# Altium schematic sheet MainBlock-Inputs.SchDoc
size A4
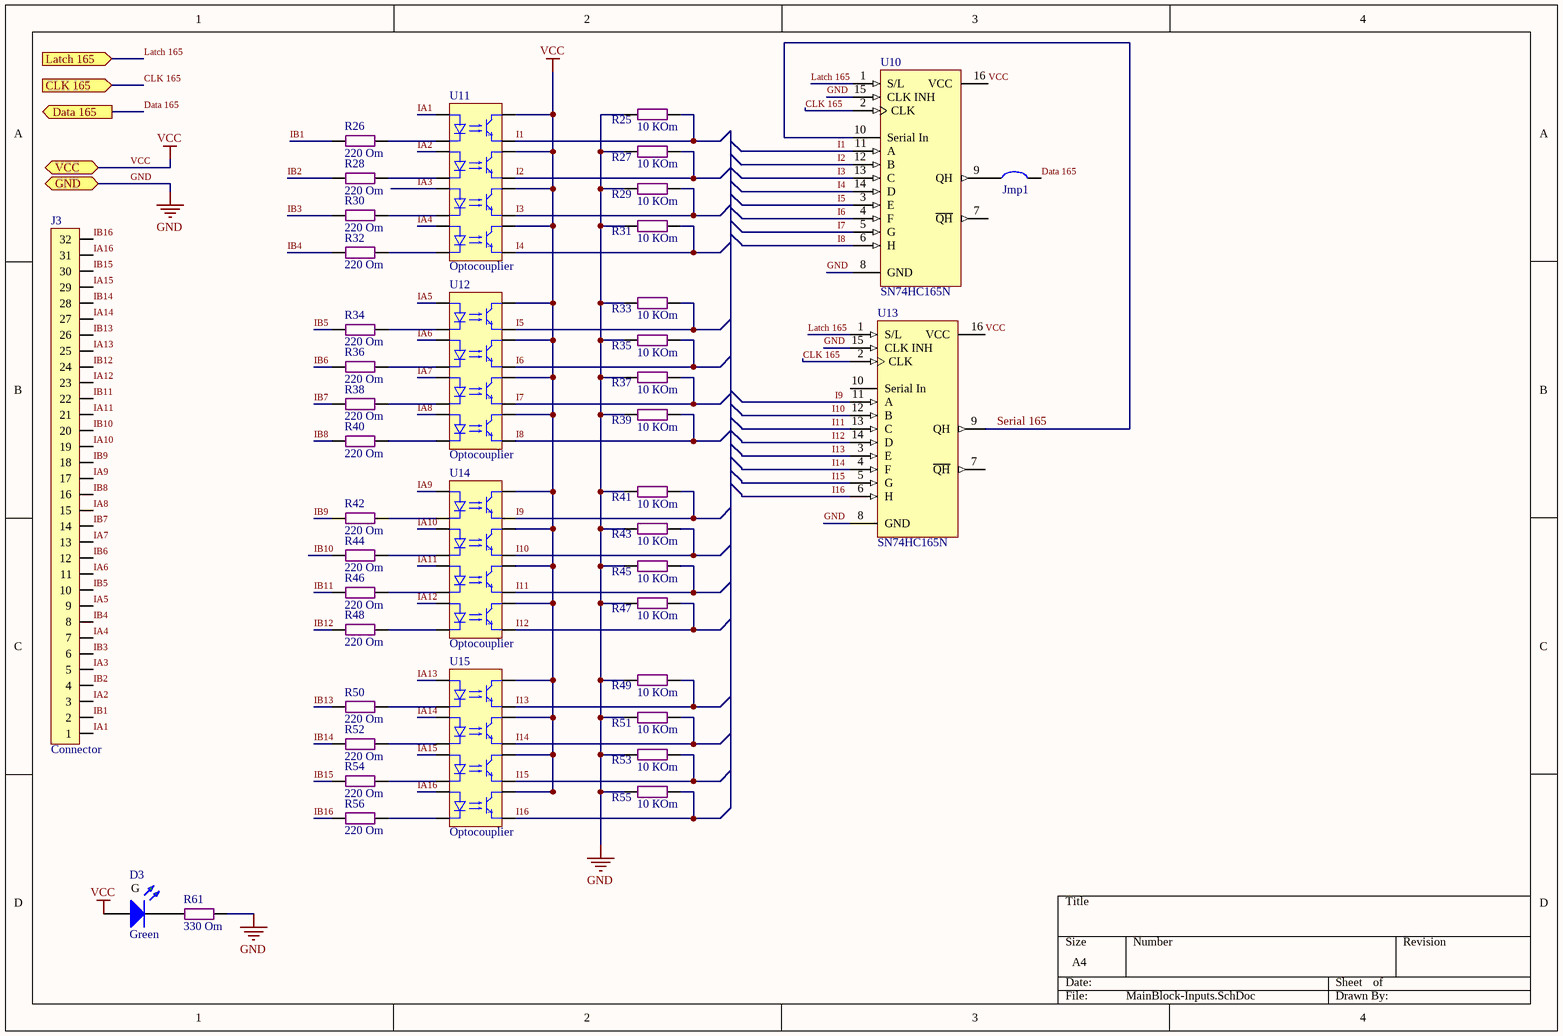
[diagram p0: MainBlock-Inputs.SchDoc]

## Parts
D3  Green  [LED SMD 0805 Green]
J3  Connector  [LINE 2.54 x 16D]
Jmp1  Jumper  [Jumper S 13x4]  (value not drawn)
R25  10 КOm  [SMD 0603 (1608)]
R26  220 Om  [SMD 1206 (3216)]
R27  10 КOm  [SMD 0603 (1608)]
R28  220 Om  [SMD 1206 (3216)]
R29  10 КOm  [SMD 0603 (1608)]
R30  220 Om  [SMD 1206 (3216)]
R31  10 КOm  [SMD 0603 (1608)]
R32  220 Om  [SMD 1206 (3216)]
R33  10 КOm  [SMD 0603 (1608)]
R34  220 Om  [SMD 1206 (3216)]
R35  10 КOm  [SMD 0603 (1608)]
R36  220 Om  [SMD 1206 (3216)]
R37  10 КOm  [SMD 0603 (1608)]
R38  220 Om  [SMD 1206 (3216)]
R39  10 КOm  [SMD 0603 (1608)]
R40  220 Om  [SMD 1206 (3216)]
R41  10 КOm  [SMD 0603 (1608)]
R42  220 Om  [Res p7.62 (4p)]
R43  10 КOm  [SMD 0603 (1608)]
R44  220 Om  [Res p7.62 (4p)]
R45  10 КOm  [SMD 0603 (1608)]
R46  220 Om  [Res p7.62 (4p)]
R47  10 КOm  [SMD 0603 (1608)]
R48  220 Om  [Res p7.62 (4p)]
R49  10 КOm  [SMD 0603 (1608)]
R50  220 Om  [SMD 1206 (3216)]
R51  10 КOm  [SMD 0603 (1608)]
R52  220 Om  [SMD 1206 (3216)]
R53  10 КOm  [SMD 0603 (1608)]
R54  220 Om  [SMD 1206 (3216)]
R55  10 КOm  [SMD 0603 (1608)]
R56  220 Om  [SMD 1206 (3216)]
R61  330 Om  [SMD 0603 (1608)]
U10  SN74HC165N  [DIP16]
U11  Optocouplier  [DIP16]
U12  Optocouplier  [DIP16]
U13  SN74HC165N  [DIP16]
U14  Optocouplier  [DIP16]
U15  Optocouplier  [DIP16]

## Ports
CLK 165 (in), Data 165 (out), GND, Latch 165 (in), VCC

## Nets
GND: R25.1 R27.1 R29.1 R31.1 R33.1 R35.1 R37.1 R39.1 R41.1 R43.1 R45.1 R47.1 R49.1 R51.1 R53.1 R55.1 R61.2 U10.8(GND) U10.15(CLK_INH) U13.8(GND) U13.15(CLK_INH) ; port GND
VCC: D3.A U10.16(VCC) U11.10 U11.12 U11.14 U11.16 U12.10 U12.12 U12.14 U12.16 U13.16(VCC) U14.10 U14.12 U14.14 U14.16 U15.10 U15.12 U15.14 U15.16 ; port VCC
CLK 165: U10.2(CLK) U13.2(CLK) ; port CLK 165
Data 165: Jmp1.2 ; port Data 165
I1: R25.2 U10.11(A) U11.15
I2: R27.2 U10.12(B) U11.13
I3: R29.2 U10.13(C) U11.11
I4: R31.2 U10.14(D) U11.9
I5: R33.2 U10.3(E) U12.15
I6: R35.2 U10.4(F) U12.13
I7: R37.2 U10.5(G) U12.11
I8: R39.2 U10.6(H) U12.9
I9: R41.2 U13.11(A) U14.15
I10: R43.2 U13.12(B) U14.13
I11: R45.2 U13.13(C) U14.11
I12: R47.2 U13.14(D) U14.9
I13: R49.2 U13.3(E) U15.15
I14: R51.2 U13.4(F) U15.13
I15: R53.2 U13.5(G) U15.11
I16: R55.2 U13.6(H) U15.9
IA1: J3.1 U11.1
IA2: J3.3 U11.3
IA3: J3.5 U11.5
IA4: J3.7 U11.7
IA5: J3.9 U12.1
IA6: J3.11 U12.3
IA7: J3.13 U12.5
IA8: J3.15 U12.7
IA9: J3.17 U14.1
IA10: J3.19 U14.3
IA11: J3.21 U14.5
IA12: J3.23 U14.7
IA13: J3.25 U15.1
IA14: J3.27 U15.3
IA15: J3.29 U15.5
IA16: J3.31 U15.7
IB1: J3.2 R26.1
IB2: J3.4 R28.1
IB3: J3.6 R30.1
IB4: J3.8 R32.1
IB5: J3.10 R34.1
IB6: J3.12 R36.1
IB7: J3.14 R38.1
IB8: J3.16 R40.1
IB9: J3.18 R42.1
IB10: J3.20 R44.1
IB11: J3.22 R46.1
IB12: J3.24 R48.1
IB13: J3.26 R50.1
IB14: J3.28 R52.1
IB15: J3.30 R54.1
IB16: J3.32 R56.1
Latch 165: U10.1(S/L) U13.1(S/L) ; port Latch 165
Serial 165: U10.10(Serial_In) U13.9(QH)
NetD3_K: D3.K R61.1
NetJmp1_1: Jmp1.1 U10.9(QH)
NetR26_2: R26.2 U11.2
NetR28_2: R28.2 U11.4
NetR30_2: R30.2 U11.6
NetR32_2: R32.2 U11.8
NetR34_2: R34.2 U12.2
NetR36_2: R36.2 U12.4
NetR38_2: R38.2 U12.6
NetR40_2: R40.2 U12.8
NetR42_2: R42.2 U14.2
NetR44_2: R44.2 U14.4
NetR46_2: R46.2 U14.6
NetR48_2: R48.2 U14.8
NetR50_2: R50.2 U15.2
NetR52_2: R52.2 U15.4
NetR54_2: R54.2 U15.6
NetR56_2: R56.2 U15.8

Not connected (* = marked no-connect by the designer): U10 7(~{QH}); U13 7(~{QH}) 10(Serial_In)

## Notes on the sheet
- (in symbol Led SMD 0805 Green) G

## Library data of the parts
D3 = Led SMD 0805 Green: ?2v ?20mA; Forward Voltage TYP: ?2; Resistor for 5v VCC: 330 Om; Forward Voltage Min: ?; Wave len min/typ: ?; Liminous Min (mcd): ?; Liminous Typ (mcd): ?; Forward Amp (mA): ?; Color: Green
J3 = Connector Dbl ( 32 pin ): 32pin Connector
R25-R56 R61 = Resistor
U10 U13 = SN74HC165N: 8-Bit Parallel-Load Shift Register; Published: 8-Jun-2000; LatestRevisionDate: 04-Mar-2005; LatestRevisionNote: Stylized 3D Model Added.; DatasheetVersion: May-1997; PackageVersion: Oct-1995; PackageReference: N016; Publisher: Altium Limited; PackageDescription: DIP; 16 Leads; Row Spacing 7.62 mm; Pitch 2.54 mm; Code_JEDEC: MS-001-BB; ComponentLink1Description: Manufacturer Link; ComponentLink1URL: http://www.ti.com/; ComponentLink2Description: Datasheet; ComponentLink2URL: http://www-s.ti.com/sc/ds/sn74hc165.pdf
U11 U12 U14 U15 = Optocouplier 4x: 4x channel; LTV847 Datasheet: http://lib.chipdip.ru/224/DOC000224974.pdf